# Altium schematic sheet chess_module_connectors.SchDoc
size A; SheetNumber: 3; SheetTotal: 3
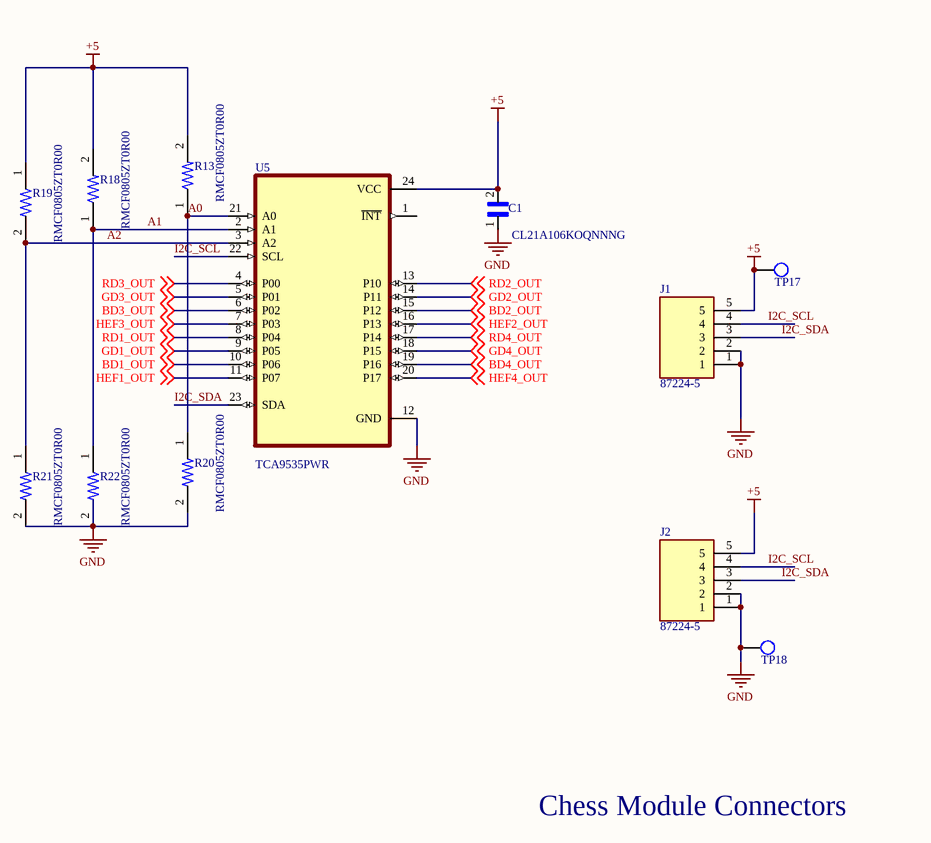
[diagram p0: chess_module_connectors.SchDoc]

## Parts
C1  CL21A106KOQNNNG  [CAPC2012X140N]
J1  87224-5  [TE_87224-5]
J2  87224-5  [TE_87224-5]
R13  RMCF0805ZT0R00  [RESC2012X60N]
R18  RMCF0805ZT0R00  [RESC2012X60N]
R19  RMCF0805ZT0R00  [RESC2012X60N]
R20  RMCF0805ZT0R00  [RESC2012X60N]
R21  RMCF0805ZT0R00  [RESC2012X60N]
R22  RMCF0805ZT0R00  [RESC2012X60N]
TP17  TP_1206  [TP-SMC-1206]  (value not drawn)
TP18  TP_1206  [TP-SMC-1206]  (value not drawn)
U5  TCA9535PWR  [SOP65P640X120-24N]

## Nets
+5: C1.2 J1.5 J2.5 R13.2 R18.2 R19.1 TP17.1 U5.24(VCC)
GND: C1.1 J1.1 J1.2 J2.1 J2.2 R20.2 R21.2 R22.2 TP18.1 U5.12(GND)
A0: R13.1 R20.1 U5.21(A0)
A1: R18.1 R22.1 U5.2(A1)
A2: R19.2 R21.1 U5.3(A2)
BD1_OUT: U5.10(P06) ; off-sheet BD1_OUT
BD2_OUT: U5.15(P12) ; off-sheet BD2_OUT
BD3_OUT: U5.6(P02) ; off-sheet BD3_OUT
BD4_OUT: U5.19(P16) ; off-sheet BD4_OUT
GD1_OUT: U5.9(P05) ; off-sheet GD1_OUT
GD2_OUT: U5.14(P11) ; off-sheet GD2_OUT
GD3_OUT: U5.5(P01) ; off-sheet GD3_OUT
GD4_OUT: U5.18(P15) ; off-sheet GD4_OUT
HEF1_OUT: U5.11(P07) ; off-sheet HEF1_OUT
HEF2_OUT: U5.16(P13) ; off-sheet HEF2_OUT
HEF3_OUT: U5.7(P03) ; off-sheet HEF3_OUT
HEF4_OUT: U5.20(P17) ; off-sheet HEF4_OUT
I2C_SCL: J1.4 J2.4 U5.22(SCL)
I2C_SDA: J1.3 J2.3 U5.23(SDA)
RD1_OUT: U5.8(P04) ; off-sheet RD1_OUT
RD2_OUT: U5.13(P10) ; off-sheet RD2_OUT
RD3_OUT: U5.4(P00) ; off-sheet RD3_OUT
RD4_OUT: U5.17(P14) ; off-sheet RD4_OUT

Not connected (* = marked no-connect by the designer): U5 1(~{INT})

## Notes on the sheet
- Chess Module Connectors

## Library data of the parts
C1 = CL21A106KOQNNNG: 10ÂµF Â±10% 16V Ceramic Capacitor X5R 0805 _2012 Metric_; MF: Samsung Electro-Mechanics; Package: 0805 Samsung; Digi-Key_Part_Number: 1276-6455-1-ND; Digi-Key_Purchase_URL: https://www.digikey.com/product-detail/en/samsung-electro-mechanics/CL21A106KOQNNNG/1276-6455-1-ND/5958083?utm_source=snapeda&utm_medium=aggregator&utm_campaign=symbol; Value: *; MP: CL21A106KOQNNNG; SnapEDA_Link: https://www.snapeda.com/parts/CL21A106KOQNNNG/Samsung%20Electro-Mechanics/view-part/3597829/?ref=snap
J1 J2 = 87224-5: Conn Unshrouded Header HDR 5 POS 2.54mm Solder ST Thru-Hole; Number_of_Positions: 5; MF: TE Connectivity; Product_Type: Connector; Centerline_Pitch: 2.54 mm[.1 in]; Price: None; SnapEDA_Link: https://www.snapeda.com/parts/87224-5/TE%20Connectivity%20AMP%20Connectors/view-part/1233389/?ref=snap; EU_RoHS_Compliance: Compliant; MP: 87224-5; Value: *; Availability: Good; Package: None; Purchase-URL: https://pricing.snapeda.com/search/part/87224-5/?ref=eda
R13 R18-R22 = RMCF0805ZT0R00: 0 Ohms Jumper 0.125W, 1/8W Chip Resistor 0805 (2012 Metric) Automotive AEC-Q200 Thick Film; MF: Stackpole Electronics; DigiKey-Purchase-URL: https://snapeda.com/shop?store=DigiKey&id=492501; Package: 0805 Stackpole Electronics; Availability: Unavailable; MP: RMCF0805ZT0R00; SnapEDA_Link: https://www.snapeda.com/parts/RMCF0805ZT0R00/Stackpole%20Electronics%20Inc/view-part/492501/?ref=snap; Price: None; Value: *
TP17 TP18 = TP_1206: Test Point SMD 1206; Manufacturer: TE Connectivity (Tyco Electronics); Manufacturer Part Number: 1625854-1; Resistance Value: 0 Ohm; Temperature Coefficient: N/R; Supplier: Digi-Key; Stock 1: 31937; Pricing 1: 1=0.28, 10=0.261, 25=0.224, 50=0.1902, 100=0.1828, 250=0.1641, 500=0.1567, 1000=0.1306 (USD); Case Size: 1206; Dimension: 3.2 x 1.6 x 1.25mm; Family: RC; Mounting: Surface Mount; Operating Temperature: -55 to 125 C; Part No: 1625854-1; RoHS: Yes; Packaging: Tape and Reel; Termination Style: N/R; Terminal Pitch: N/R; Power Rating: N/R; Tolerance: N/R; ComponentLink1URL: https://datasheet.ciiva.com/6439/eng-ds-1773266-a-6439169.pdf; ComponentLink1Description: https://datasheet.ciiva.com/6439/eng-ds-1773266-a-6439169.pdf; ComponentLink2URL: https://datasheet.ciiva.com/30136/1773266-a-30136341.pdf; ComponentLink2Description: https://datasheet.ciiva.com/30136/1773266-a-30136341.pdf; ComponentLink3URL: https://datasheet.ciiva.com/6439/eng-ds-1773266-a-6439080.pdf; ComponentLink3Description: https://datasheet.ciiva.com/6439/eng-ds-1773266-a-6439080.pdf; ComponentLink4URL: https://datasheet.ciiva.com/6439/eng-ds-1773266-a-6439081.pdf; ComponentLink4Description: https://datasheet.ciiva.com/6439/eng-ds-1773266-a-6439081.pdf; ComponentLink5URL: https://datasheet.ciiva.com/6439/eng-ds-1773266-a-6439083.pdf; ComponentLink5Description: https://datasheet.ciiva.com/6439/eng-ds-1773266-a-6439083.pdf; Supplier Part Number: A106143CT-ND
U5 = TCA9535PWR: Remote 16-Bit I2C and SMBus, Low-Power I/O Expander With Interrupt Output and Config Registers 24-TSSOP -40 to 85; MF: Texas Instruments; Texas_Instruments-Purchase-URL: https://snapeda.com/shop?store=Texas+Instruments&id=1237891; SnapEDA_Link: https://www.snapeda.com/parts/TCA9535PWR/Texas%20Instruments/view-part/1237891/?ref=snap; Availability: Good; Price: None; MP: TCA9535PWR; DigiKey-Purchase-URL: https://snapeda.com/shop?store=DigiKey&id=1237891; Package: TSSOP-24 Texas Instruments; Mouser-Purchase-URL: https://snapeda.com/shop?store=Mouser&id=1237891; Arrow_Electronics-Purchase-URL: https://snapeda.com/shop?store=Arrow+Electronics&id=1237891; Value: *